# EAGLE design CBAM2.5 (EAGLE 5.07)
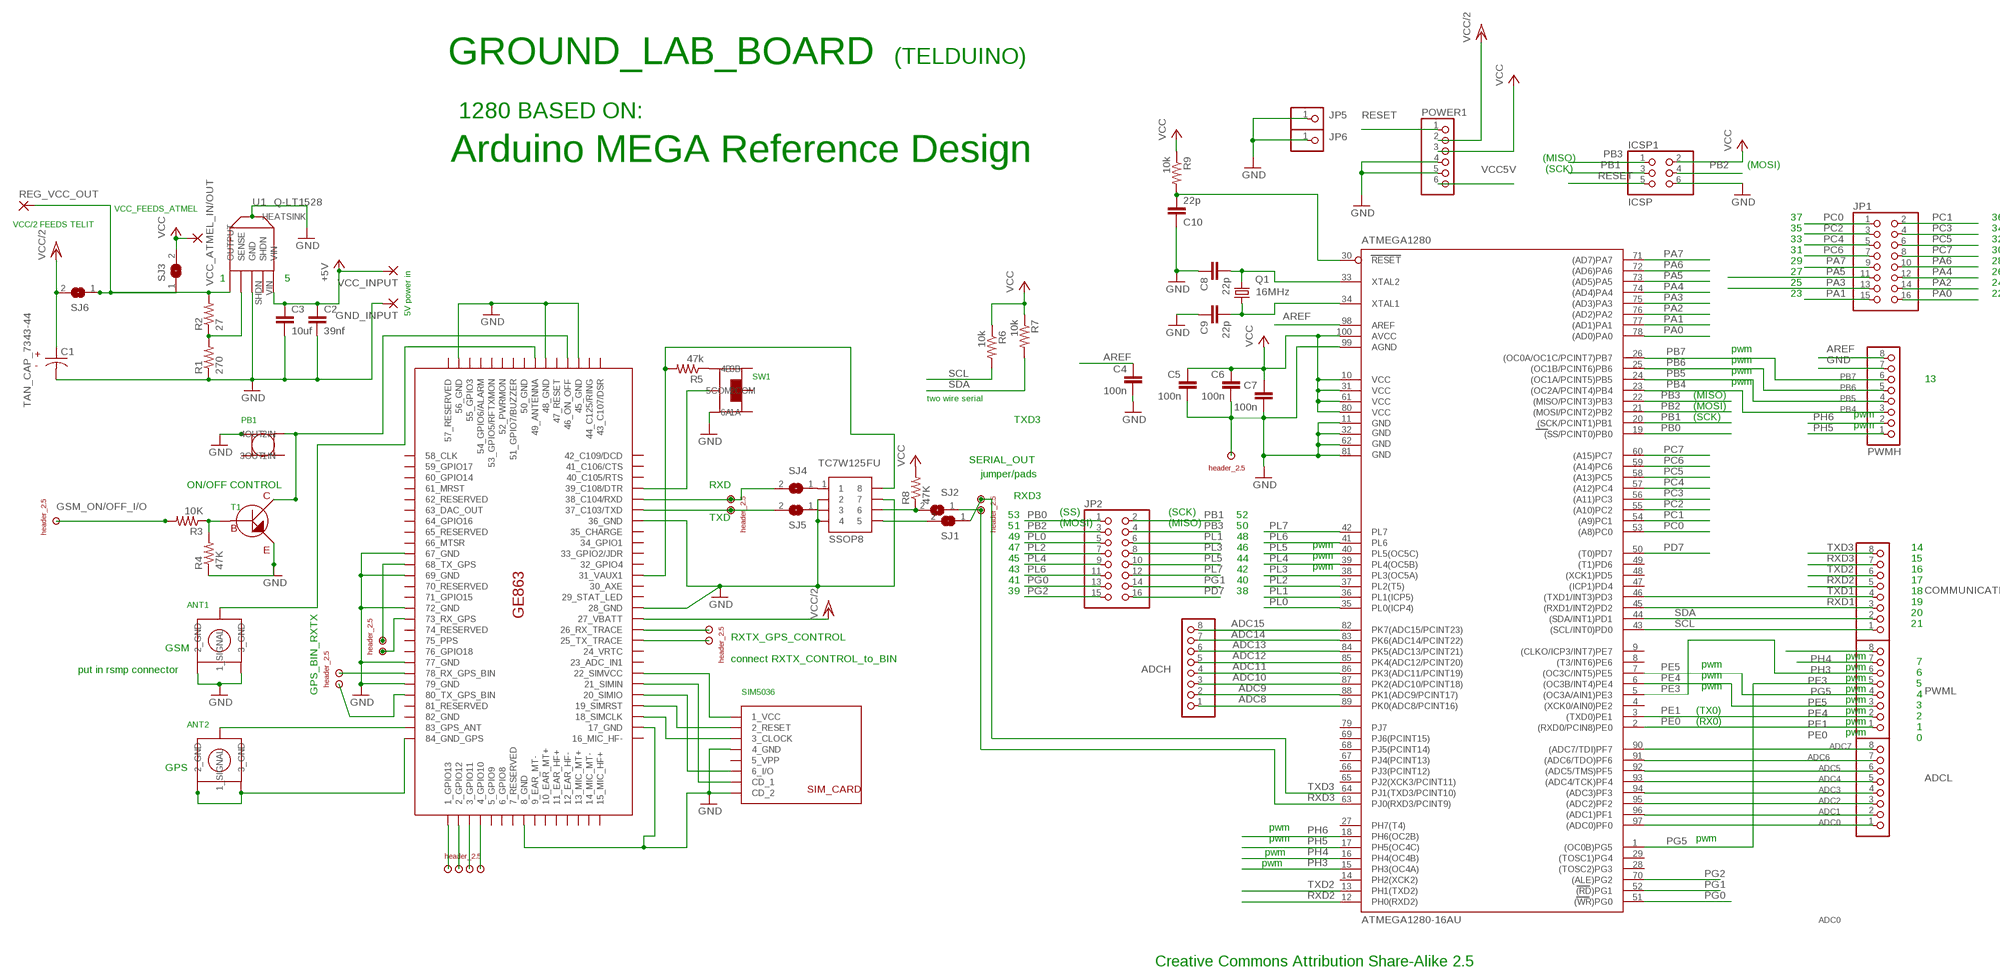
[diagram p0: schematic, sheet 1, part 1 of 2]
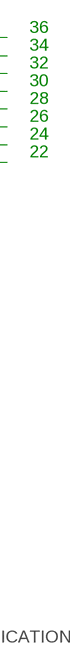
[diagram p1: schematic, sheet 1, part 2 of 2]

## Parts
ADCH  PINHD-1X8  [1X08]
ADCL  PINHD-1X8  [1X08]
AGND  2.5_1HEADER  [2.5_1HEADER]
ATMEGA1280  ATMEGA1280-16AU  [TQFP100]
C1  TAN_CAP_7343-44  [TAN_CAP_7343-44]
C2  39nf  C-EUC0805  [C0805]
C3  10uf  C-EUC1206  [C1206]
C4  100n  C-EUC0805  [C0805]
C5  100n  C-EUC0805  [C0805]
C6  100n  C-EUC0805  [C0805]
C7  100n  C-EUC0805  [C0805]
C8  22p  C-EUC0805  [C0805]
C9  22p  C-EUC0805  [C0805]
C10  22p  C-EUC0805  [C0805]
COMMUNICATION  PINHD-1X8  [1X08]
GE863  GE836  [GE836]
GND_INPUT  3,81/1,4  [3,81/1,4]
GPS_ANTENNA  U.FL_FEMALE  [U.FL_FEMALE]
GSM_ANTENNA  U.FL_FEMALE  [U.FL_FEMALE]
ICSP1  ICSP  PINHD-2X3  [2X03]
JP1  PINHD-2X8  [2X08]
JP2  PINHD-2X8  [2X08]
JP5  PINHD-1X1  [1X01]
JP6  PINHD-1X1  [1X01]
POWER  SWITCHPB_KPT-1187B  [SWITCHPB_KPT-1187B]
POWER1  PINHD-1X6  [1X06]
PWMH  PINHD-1X8  [1X08]
PWML  PINHD-1X8  [1X08]
Q1  16MHz  CRYTALHC49S  [HC49/S]
R1  270  R-US_0207/10  [0207/10]
R2  27  R-US_0207/10  [0207/10]
R3  10K  R-US_R1206  [R1206]
R4  47K  R-US_R1206  [R1206]
R5  47k  R-US_R1206  [R1206]
R6  10k  R-US_R1206  [R1206]
R7  10k  R-US_R1206  [R1206]
R8  47K  R-US_0207/10  [0207/10]
R9  10k  R-US_R1206  [R1206]
REG_VCC_OUT  3,81/1,4  [3,81/1,4]
RX/TX_ATMEL  2.5_2HEADER  [2.5_2HEADER]
RX/TX_GPS  2.5_2HEADER  [2.5_2HEADER]
RX/TX_GPS_BIN  2.5_2HEADER  [2.5_2HEADER]
RX/TX_TELIT  2.5_2HEADER  [2.5_2HEADER]
RX/TX_TRACE  2.5_2HEADER  [2.5_2HEADER]
SIM5036  SIMCARD_5036  [SIMCARD_5036]
SJ1  SJ  [SJ]
SJ2  SJ  [SJ]
SJ3  SJW  [SJW]
SJ4  SJ  [SJ]
SJ5  SJ  [SJ]
SJ6  SJW  [SJW]
SW1  SWITCHSLIDE_EG1390  [SWITCHSLIDE_EG1390]
T1  SOT-23_MMBT4403  [SOT-23_MMBT4403]
TC7W125FU  SSOP8  [SSOP8]
TELIT_I/O_PINS  2.5_4HEADER  [2.5_4HEADER]
TELIT_ON/OFF  2.5_1HEADER  [2.5_1HEADER]
U1  Q-LT1528  [Q-LT1528]
VCC_ATMEL_IN/OUT  3,81/1,4  [3,81/1,4]
VCC_INPUT  3,81/1,4  [3,81/1,4]

## Nets
1_GPIO: GE863.1_GPIO13 TELIT_I/O_PINS.P$1(H1)
2_GPIO: GE863.2_GPIO12 TELIT_I/O_PINS.P$2(H2)
3_GPIO: GE863.3_GPIO11 TELIT_I/O_PINS.P$3(H3)
4_GPIO: GE863.4_GPIO10 TELIT_I/O_PINS.P$4(H4)
25_TX_TRACE: GE863.25_TX_TRACE RX/TX_TRACE.P$2(H2)
26_RX_TRACE: GE863.26_RX_TRACE RX/TX_TRACE.P$1(H1)
31_VAUX: GE863.31_VAUX1 R5.2 TC7W125FU.8
68_TXGPS: GE863.68_TX_GPS RX/TX_GPS.P$2(H2)
73_RXGPS: GE863.73_RX_GPS RX/TX_GPS.P$1(H1)
78_RX_GPS_BIN: GE863.78_RX_GPS_BIN RX/TX_GPS_BIN.P$2(H2)
80_TX_GPS_BIN: GE863.80_TX_GPS_BIN RX/TX_GPS_BIN.P$1(H1)
ADC0: ADCL.1 ATMEGA1280.97((ADC0)PF0)
ADC1: ADCL.2 ATMEGA1280.96((ADC1)PF1)
ADC2: ADCL.3 ATMEGA1280.95((ADC2)PF2)
ADC3: ADCL.4 ATMEGA1280.94((ADC3)PF3)
ADC4: ADCL.5 ATMEGA1280.93((ADC4/TCK)PF4)
ADC5: ADCL.6 ATMEGA1280.92((ADC5/TMS)PF5)
ADC6: ADCL.7 ATMEGA1280.91((ADC6/TDO)PF6)
ADC7: ADCL.8 ATMEGA1280.90((ADC7/TDI)PF7)
ADC8: ADCH.1 ATMEGA1280.89(PK0(ADC8/PCINT16))
ADC9: ADCH.2 ATMEGA1280.88(PK1(ADC9/PCINT17))
ADC10: ADCH.3 ATMEGA1280.87(PK2(ADC10/PCINT18))
ADC11: ADCH.4 ATMEGA1280.86(PK3(ADC11/PCINT19))
ADC12: ADCH.5 ATMEGA1280.85(PK4(ADC12/PCINT20))
ADC13: ADCH.6 ATMEGA1280.84(PK5(ADC13/PCINT21))
ADC14: ADCH.7 ATMEGA1280.83(PK6(ADC14/PCINT22))
ADC15: ADCH.8 ATMEGA1280.82(PK7(ADC15/PCINT23))
AREF: ATMEGA1280.98(AREF) C4.1 PWMH.8
DTR: GE863.39_C108/DTR SW1.P$2(2COM)
GND [gnd]: AGND.P$1(H1) ATMEGA1280.11(GND) ATMEGA1280.32(GND1) ATMEGA1280.62(GND2) ATMEGA1280.81(GND3) ATMEGA1280.99(AGND) C1.NEG C2.2 C3.2 C4.2 C5.2 C6.2 C7.2 C8.1 C9.1 C10.1 GE863.8_GND GE863.17_GND GE863.28_GND GE863.36_GND GE863.45_GND GE863.48_GND GE863.56_GND GE863.67_GND GE863.69_GND GE863.72_GND GE863.77_GND GE863.79_GND GND_INPUT.1(P) GSM_ANTENNA.P$2(2_GND) GSM_ANTENNA.P$3(3_GND) ICSP1.6 JP5.1 JP6.1 POWER1.4 POWER1.5 POWER.2IN PWMH.7 R1.1 R4.1 SIM5036.4_GND SIM5036.CD_2 SW1.P$1(1A) T1.E TC7W125FU.2 TC7W125FU.4 TC7W125FU.7 U1.GND U1.HEATSINK
GSM_ON/OFF_I/O: R3.2 TELIT_ON/OFF.P$1(H1)
N$1: R8.1 SJ2.2 TC7W125FU.6
N$2: GE863.49_ANTENNA GSM_ANTENNA.P$1(1_SIGNAL)
N$3: SJ5.1 TC7W125FU.3
N$4: R5.1 SW1.P$3(3B)
N$5: SJ4.1 TC7W125FU.1
N$6: ATMEGA1280.34(XTAL1) C9.2 Q1.1
N$7: ATMEGA1280.33(XTAL2) C8.2 Q1.2
N$23: GE863.83_GPS_ANT GPS_ANTENNA.P$1(1_SIGNAL)
N$25: GE863.22_SIMVCC SIM5036.1_VCC
N$26: GE863.21_SIMIN SIM5036.CD_1
N$27: GE863.20_SIMIO SIM5036.6_I/O
N$28: GE863.19_SIMRST SIM5036.2_RESET
N$29: GE863.18_SIMCLK SIM5036.3_CLOCK
N$34: GE863.84_GND_GPS GPS_ANTENNA.P$2(2_GND) GPS_ANTENNA.P$3(3_GND)
N$53: R3.1 R4.2 T1.B
ON/OFF: GE863.46_ON_OFF POWER.4OUT T1.C
PA0: ATMEGA1280.78((AD0)PA0) JP1.16
PA1: ATMEGA1280.77((AD1)PA1) JP1.15
PA2: ATMEGA1280.76((AD2)PA2) JP1.14
PA3: ATMEGA1280.75((AD3)PA3) JP1.13
PA4: ATMEGA1280.74((AD4)PA4) JP1.12
PA5: ATMEGA1280.73((AD5)PA5) JP1.11
PA6: ATMEGA1280.72((AD6)PA6) JP1.10
PA7: ATMEGA1280.71((AD7)PA7) JP1.9
PB0: ATMEGA1280.19((SS/PCINT0)PB0) JP2.1
PB1: ATMEGA1280.20((SCK/PCINT1)PB1) ICSP1.3 JP2.2
PB2: ATMEGA1280.21((MOSI/PCINT2)PB2) ICSP1.4 JP2.3
PB3: ATMEGA1280.22((MISO/PCINT3)PB3) ICSP1.1 JP2.4
PB4: ATMEGA1280.23((OC2A/PCINT4)PB4) PWMH.3
PB5: ATMEGA1280.24((OC1A/PCINT5)PB5) PWMH.4
PB6: ATMEGA1280.25((OC1B/PCINT6)PB6) PWMH.5
PB7: ATMEGA1280.26((OC0A/OC1C/PCINT7)PB7) PWMH.6
PC0: ATMEGA1280.53((A8)PC0) JP1.1
PC1: ATMEGA1280.54((A9)PC1) JP1.2
PC2: ATMEGA1280.55((A10)PC2) JP1.3
PC3: ATMEGA1280.56((A11)PC3) JP1.4
PC4: ATMEGA1280.57((A12)PC4) JP1.5
PC5: ATMEGA1280.58((A13)PC5) JP1.6
PC6: ATMEGA1280.59((A14)PC6) JP1.7
PC7: ATMEGA1280.60((A15)PC7) JP1.8
PD7: ATMEGA1280.50((T0)PD7) JP2.16
PE0: ATMEGA1280.2((RXD0/PCIN8)PE0) PWML.1
PE1: ATMEGA1280.3((TXD0)PE1) PWML.2
PE3: ATMEGA1280.5((OC3A/AIN1)PE3) PWML.6
PE4: ATMEGA1280.6((OC3B/INT4)PE4) PWML.3
PE5: ATMEGA1280.7((OC3C/INT5)PE5) PWML.4
PG0: ATMEGA1280.51((WR)PG0) JP2.13
PG1: ATMEGA1280.52((RD)PG1) JP2.14
PG2: ATMEGA1280.70((ALE)PG2) JP2.15
PG5: ATMEGA1280.1((OC0B)PG5) PWML.5
PH3: ATMEGA1280.15(PH3(OC4A)) PWML.7
PH4: ATMEGA1280.16(PH4(OC4B)) PWML.8
PH5: ATMEGA1280.17(PH5(OC4C)) PWMH.1
PH6: ATMEGA1280.18(PH6(OC2B)) PWMH.2
PL0: ATMEGA1280.35(PL0(ICP4)) JP2.5
PL1: ATMEGA1280.36(PL1(ICP5)) JP2.6
PL2: ATMEGA1280.37(PL2(T5)) JP2.7
PL3: ATMEGA1280.38(PL3(OC5A)) JP2.8
PL4: ATMEGA1280.39(PL4(OC5B)) JP2.9
PL5: ATMEGA1280.40(PL5(OC5C)) JP2.10
PL6: ATMEGA1280.41(PL6) JP2.11
PL7: ATMEGA1280.42(PL7) JP2.12
REG_OUTPUT [power]: R2.2 REG_VCC_OUT.1(P) SJ3.1 SJ6.1 U1.OUTPUT
RESET: ATMEGA1280.30(RESET) C10.2 ICSP1.5 POWER1.1 R9.2
RXD: GE863.38_C104/RXD RX/TX_TELIT.P$1(H1) SJ4.2
RXD1: ATMEGA1280.45((RXD1/INT2)PD2) COMMUNICATION.3
RXD2: ATMEGA1280.12(PH0(RXD2)) COMMUNICATION.5
RXD3: ATMEGA1280.63(PJ0(RXD3/PCINT9)) COMMUNICATION.7 RX/TX_ATMEL.P$2(H2) SJ2.1
SCL: ATMEGA1280.43((SCL/INT0)PD0) COMMUNICATION.1 R6.2
SDA: ATMEGA1280.44((SDA/INT1)PD1) COMMUNICATION.2 R7.2
SENCE: R1.2 R2.1 U1.SENCE(SENSE)
TXD: GE863.37_C103/TXD RX/TX_TELIT.P$2(H2) SJ5.2
TXD1: ATMEGA1280.46((TXD1/INT3)PD3) COMMUNICATION.4
TXD2: ATMEGA1280.13(PH1(TXD2)) COMMUNICATION.6
TXD3: ATMEGA1280.64(PJ1(TXD3/PCINT10)) COMMUNICATION.8 RX/TX_ATMEL.P$1(H1) SJ1.1
TXD_IN: SJ1.2 TC7W125FU.5
VCC [VCC]: ATMEGA1280.10(VCC) ATMEGA1280.31(VCC1) ATMEGA1280.61(VCC2) ATMEGA1280.80(VCC3) ATMEGA1280.100(AVCC) C5.1 C6.1 C7.1 ICSP1.2 POWER1.3 R6.1 R7.1 R8.2 R9.1 SJ3.2 VCC_ATMEL_IN/OUT.1(P)
VCC5V [power]: C2.1 C3.1 POWER1.6 U1.VIN VCC_INPUT.1(P) ; supply symbol labelled +5V
VCC/2 [power]: C1.POS GE863.27_VBATT POWER1.2 SJ6.2
Unconnected: ATMEGA1280.4((XCK0/AIN0)PE2) ATMEGA1280.8((T3/INT6)PE6) ATMEGA1280.9((CLKO/ICP3/INT7)PE7) ATMEGA1280.14(PH2(XCK2)) ATMEGA1280.27(PH7(T4)) ATMEGA1280.28((TOSC2)PG3) ATMEGA1280.29((TOSC1)PG4) ATMEGA1280.47((ICP1)PD4) ATMEGA1280.48((XCK1)PD5) ATMEGA1280.49((T1)PD6) ATMEGA1280.65(PJ2(XCK3/PCINT11)) ATMEGA1280.66(PJ3(PCINT12)) ATMEGA1280.67(PJ4(PCINT13)) ATMEGA1280.68(PJ5(PCINT14)) ATMEGA1280.69(PJ6(PCINT15)) ATMEGA1280.79(PJ7) GE863.5_GPIO9 GE863.6_GPIO8 GE863.7_RESERVED GE863.9_EAR_MT- GE863.10_EAR_MT+ GE863.11_EAR_HF+ GE863.12_EAR_HF- GE863.13_MIC_MT+ GE863.14_MIC_MT- GE863.15_MIC_HF+ GE863.16_MIC_HF- GE863.23_ADC_IN1 GE863.24_VRTC GE863.29_STAT_LED GE863.30_AXE GE863.32_GPIO4 GE863.33_GPIO2/JDR GE863.34_GPIO1 GE863.35_CHARGE GE863.40_C105/RTS GE863.41_C106/CTS GE863.42_C109/DCD GE863.43_C107/DSR GE863.44_C125/RING GE863.47_RESET GE863.50_GND GE863.51_GPIO7/BUZZER GE863.52_PWRMON GE863.53_GPIO5/RFTXMON GE863.54_GPIO6/ALARM GE863.55_GPIO3 GE863.57_RESERVED GE863.58_CLK GE863.59_GPIO17 GE863.60_GPIO14 GE863.61_MRST GE863.62_RESERVED GE863.63_DAC_OUT GE863.64_GPIO16 GE863.65_RESERVED GE863.66_MTSR GE863.70_RESERVED GE863.71_GPIO15 GE863.74_RESERVED GE863.75_PPS GE863.76_GPIO18 GE863.81_RESERVED GE863.82_GND POWER.1IN POWER.3OUT SIM5036.5_VPP SW1.P$4(4B) SW1.P$5(5COM) SW1.P$6(6A) U1.SHDN

## Notes on the sheet
- GROUND_LAB_BOARD | (TELDUINO)
- 1280 BASED ON:
- Arduino MEGA Reference Design | (MISO)
- (MOSI)
- (SCK)
- VCC_FEEDS_ATMEL
- 37 | 36
- VCC/2 FEEDS TELIT
- 35 | 34
- 33 | 32
- 31 | 30
- 29 | 28
- 5V power in
- 27 | 26
- 1 | 5
- 25 | 24
- 23 | 22
- pwm
- pwm
- pwm
- SW1
- pwm | 13
- (MISO)
- two wire serial
- (MOSI)
- (SCK) | pwm
- PB1 | TXD3
- pwm
- SERIAL_OUT
- jumper/pads
- ON/OFF CONTROL | RXD
- RXD3
- T1
- 53 | (SS) | (SCK) | 52
- TXD
- 51 | (MOSI) | (MISO) | 50
- 49 | 48
- 47 | 46 | pwm | 14
- 45 | 44 | pwm | 15
- 43 | 42 | pwm | 16
- 41 | 40 | 17
- 39 | 38 | 18
- 19
- ANT1
- 20
- 21
- RXTX_GPS_CONTROL
- GSM
- connect RXTX_CONTROL_to_BIN | pwm
- pwm | 7
- put in rsmp connector | pwm
- pwm | 6
- pwm
- pwm | 5
- GPS_BIN_RXTX | pwm
- SIM5036
- 4
- pwm
- 3
- (TX0) | pwm
- 2
- (RX0) | pwm
- ANT2
- 1
- pwm
- 0
- GPS
- pwm
- pwm | pwm
- pwm
- pwm
- Creative Commons Attribution Share-Alike 2.5

## Library data of the parts
ADCH ADCL COMMUNICATION PWMH PWML = pinhead:PINHD-1X8: PIN HEADER
AGND TELIT_ON/OFF = myHeaders:2.5_1HEADER
ATMEGA1280 = atmel-2005:ATMEGA*: MICROCONTROLLER 64/128/256 Kbytes FLASH 4 Kbytes EEPROM 8 Kbytes SRAM 86 General Purpose I/O pins 12-channels16-bit PWM 4 x Serial USARTs 16-channels 10-bit A/D
C1 = myLib:TAN_CAP_7343-44
C2-C10 = rcl:C-EU: CAPACITOR, European symbol
GE863 = myLib:GE836
GND_INPUT REG_VCC_OUT VCC_ATMEL_IN/OUT VCC_INPUT = wirepad:3,81/1,4: THROUGH-HOLE PAD
GPS_ANTENNA GSM_ANTENNA = myLib:U.FL_FEMALE
ICSP1 = pinhead:PINHD-2X3: PIN HEADER
JP1 JP2 = pinhead:PINHD-2X8: PIN HEADER
JP5 JP6 = pinhead:PINHD-1X1: PIN HEADER
POWER = myLib:SWITCHPB_KPT-1187B
POWER1 = pinhead:PINHD-1X6: PIN HEADER
Q1 = crystal:CRYTAL: CRYSTAL
R1-R9 = rcl:R-US_: RESISTOR, American symbol
RX/TX_ATMEL RX/TX_GPS RX/TX_GPS_BIN RX/TX_TELIT RX/TX_TRACE = myHeaders:2.5_2HEADER
SIM5036 = myLib:SIMCARD_5036
SJ1-SJ6 = jumper:SJ: SMD solder JUMPER
SW1 = myLib:SWITCHSLIDE_EG1390
T1 = mytransistors:SOT-23_MMBT4403
TC7W125FU = myIC:SSOP8: ssop8 package
TELIT_I/O_PINS = myHeaders:2.5_4HEADER: 2.5mm header spacing 1mm holes
U1 = myPowerRegulators:Q-LT1528: Q package for the LT1528 power Regulator, the heatsink connects to GND

## Net classes
0 default: width 0.203 mm, drill 0.406 mm, clearance 0.203 mm
1 power: width 0.61 mm, drill 0.711 mm, clearance 0.203 mm
2 gnd: width 0.305 mm, drill 0.711 mm, clearance 0.203 mm
3 VCC: width 0.508 mm, drill 0.711 mm, clearance 0.203 mm

## Board
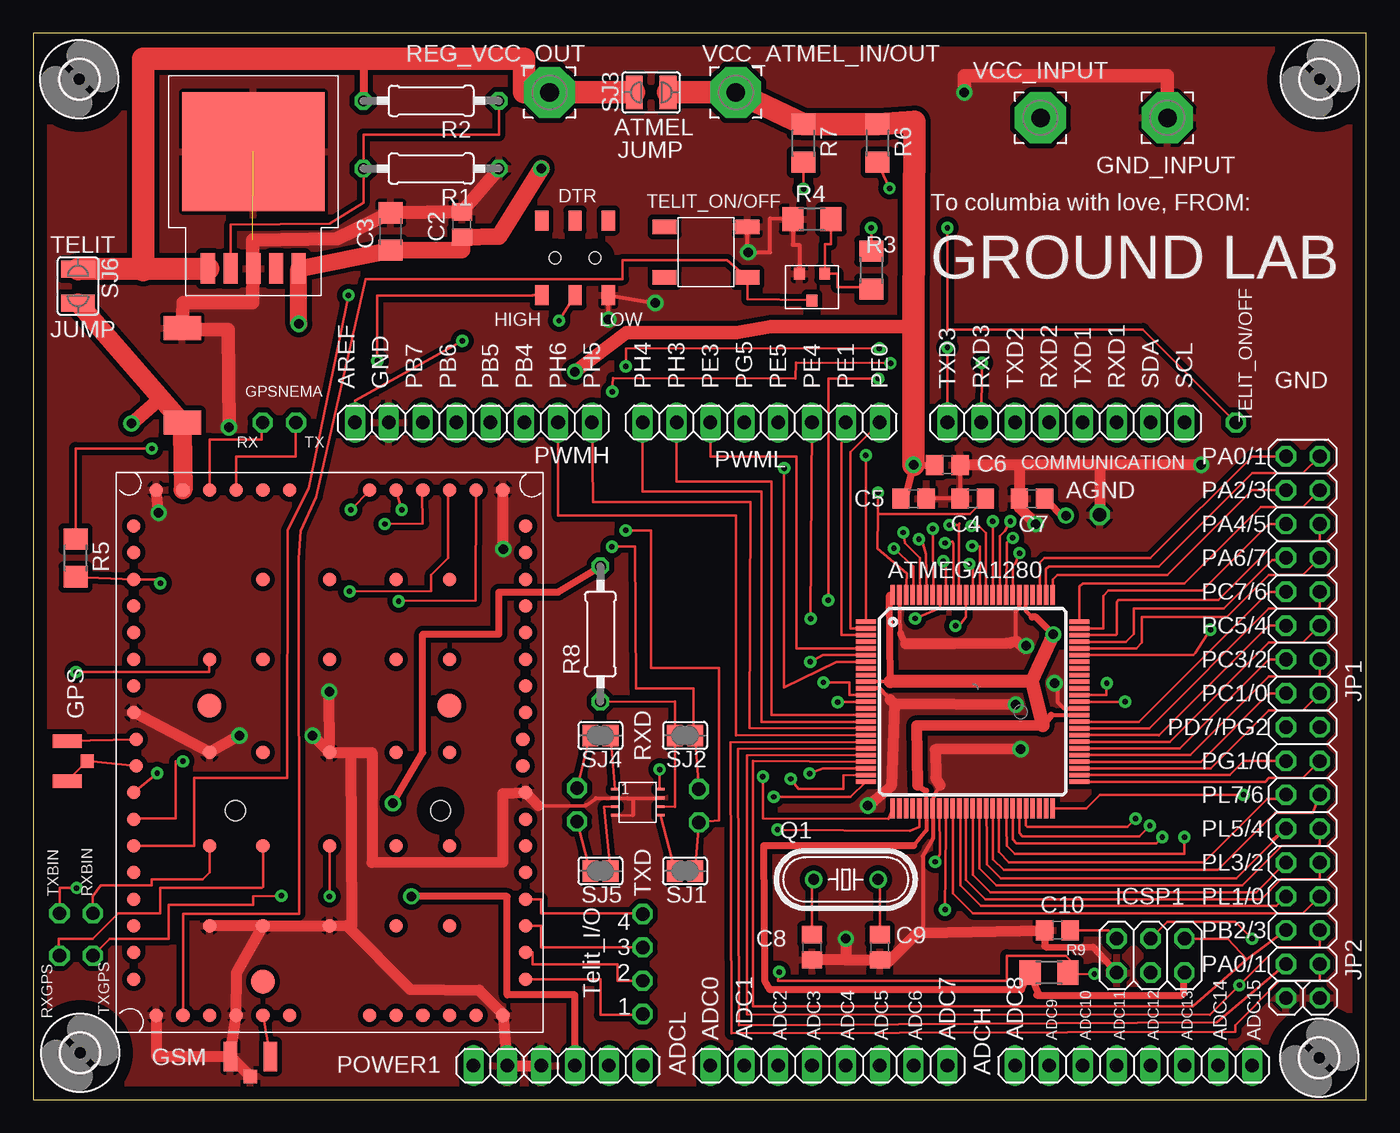
[diagram p2: board, top side]
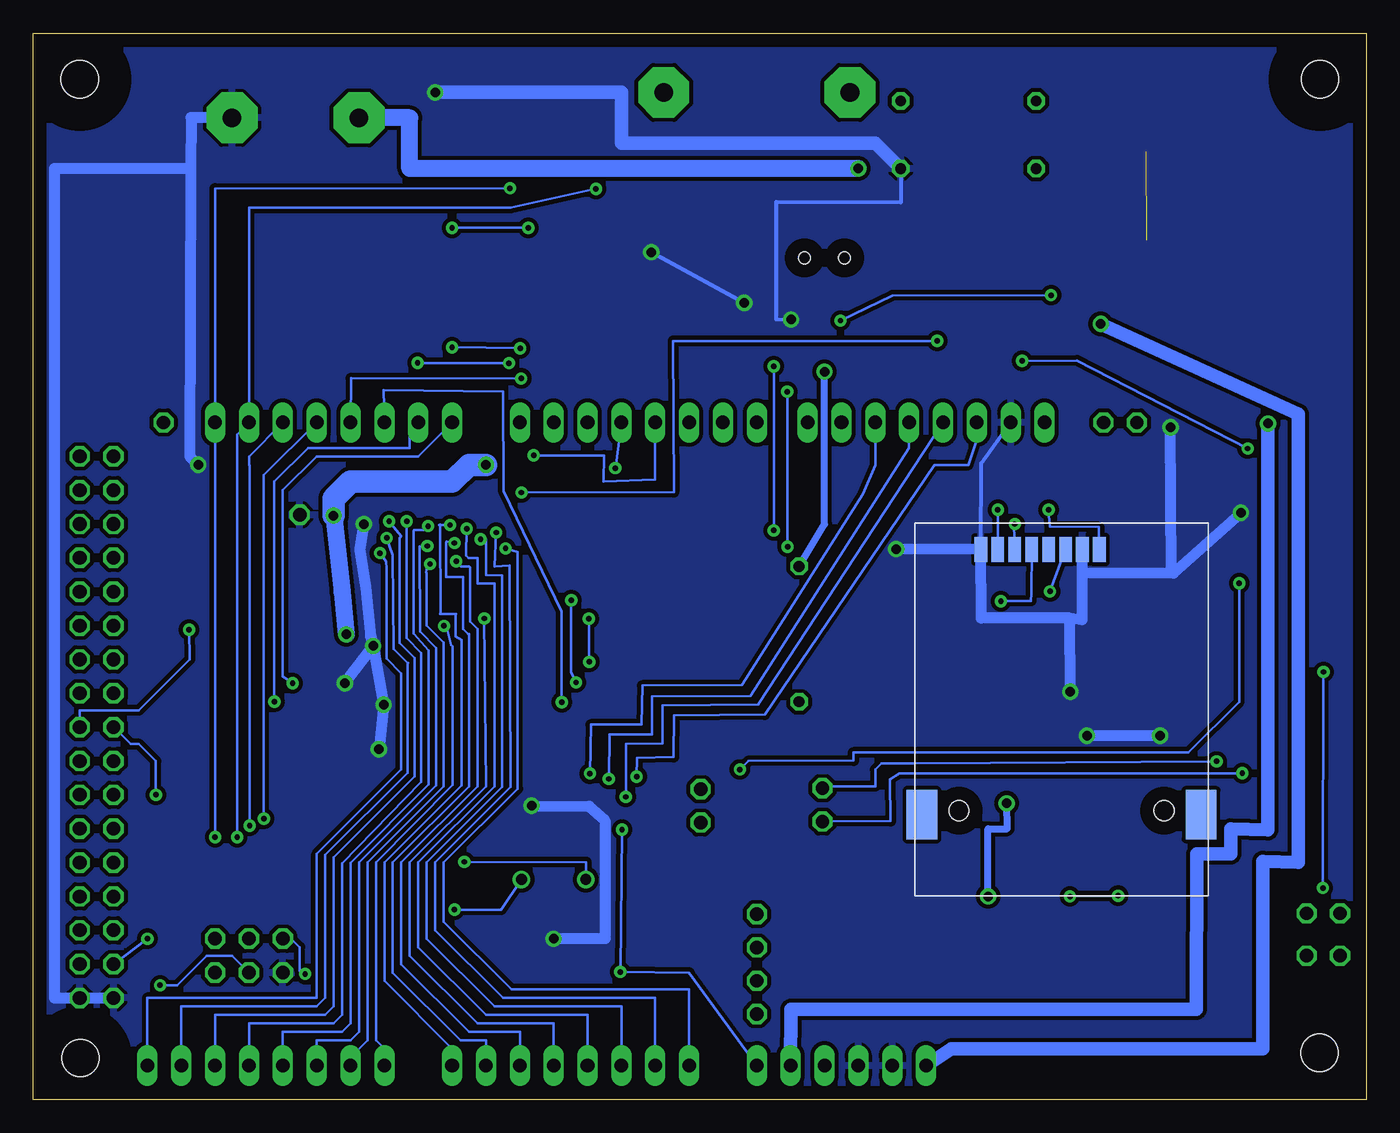
[diagram p3: board, bottom side, seen from below]

Size 100 x 80 mm. Coordinates in mm from the lower left corner, seen from the top.
Outline: 0,0 100,0 100,80 0,80 0,0
Copper layers (1*16): Top 0.035mm / dielectric 1.5mm / Bottom 0.035mm
Design rules "default *": minimum track width 8mil, minimum drill 16mil, track to track 8mil, track to pad 8mil, pad to pad 8mil, via to via 10mil, smd to smd 8mil, copper to edge 40mil, drill to drill 12mil, minimum pad ring 10mil, minimum via ring 10mil, stop-mask expansion 4mil, vias tented up to drill 0mil, thermal gap 10mil

### Footprints (pad centres in the part's own frame; a part is rotated, then mirrored left to right if it is on the bottom)
1X08 = drill 1.016 long: 1 -8.89,0; 2 -6.35,0; 3 -3.81,0; 4 -1.27,0; 5 1.27,0; 6 3.81,0; 7 6.35,0; 8 8.89,0
2.5_1HEADER = drill 1 octagon: P$1 0.06,0
TQFP100 = smd 1.5 x 0.35: 1 -8,6; 2 -8,5.5; 3 -8,5; 4 -8,4.5; 5 -8,4; 6 -8,3.5; 7 -8,3; 8 -8,2.5; 9 -8,2; 10 -8,1.5; 11 -8,1; 12 -8,0.5; 13 -8,0; 14 -8,-0.5; 15 -8,-1; 16 -8,-1.5; 17 -8,-2; 18 -8,-2.5; 19 -8,-3; 20 -8,-3.5; 21 -8,-4; 22 -8,-4.5; 23 -8,-5; 24 -8,-5.5; 25 -8,-6; 51 8,-6; 52 8,-5.5; 53 8,-5; 54 8,-4.5; 55 8,-4; 56 8,-3.5; 57 8,-3; 58 8,-2.5; 59 8,-2; 60 8,-1.5; 61 8,-1; 62 8,-0.5; 63 8,0; 64 8,0.5; 65 8,1; 66 8,1.5; 67 8,2; 68 8,2.5; 69 8,3; 70 8,3.5; 71 8,4; 72 8,4.5; 73 8,5; 74 8,5.5; 75 8,6 | smd 0.35 x 1.5: 26 -6,-8; 27 -5.5,-8; 28 -5,-8; 29 -4.5,-8; 30 -4,-8; 31 -3.5,-8; 32 -3,-8; 33 -2.5,-8; 34 -2,-8; 35 -1.5,-8; 36 -1,-8; 37 -0.5,-8; 38 0,-8; 39 0.5,-8; 40 1,-8; 41 1.5,-8; 42 2,-8; 43 2.5,-8; 44 3,-8; 45 3.5,-8; 46 4,-8; 47 4.5,-8; 48 5,-8; 49 5.5,-8; 50 6,-8; 76 6,8; 77 5.5,8; 78 5,8; 79 4.5,8; 80 4,8; 81 3.5,8; 82 3,8; 83 2.5,8; 84 2,8; 85 1.5,8; 86 1,8; 87 0.5,8; 88 0,8; 89 -0.5,8; 90 -1,8; 91 -1.5,8; 92 -2,8; 93 -2.5,8; 94 -3,8; 95 -3.5,8; 96 -4,8; 97 -4.5,8; 98 -5,8; 99 -5.5,8; 100 -6,8
TAN_CAP_7343-44 = smd 2.8 x 1.8: NEG 0,-3.5; POS 0,3.6
C0805 = smd 1.3 x 1.5: 1 -0.95,0; 2 0.95,0
C1206 = smd 1.6 x 1.8: 1 -1.4,0; 2 1.4,0
GE836 = smd 1 x 1: 1_GPIO13 -14.7,17; 2_GPIO12 -14.7,15; 3_GPIO11 -14.7,13; 4_GPIO10 -14.7,11; 5_GPIO9 -14.7,9; 6_GPIO8 -14.7,7; 7_RESERVED -14.7,5; 8_GND -14.7,3; 9_EAR_MT- -14.7,-3; 10_EAR_MT+ -14.7,-5; 11_EAR_HF+ -14.7,-7; 12_EAR_HF- -14.7,-9; 13_MIC_MT+ -14.7,-11; 14_MIC_MT- -14.7,-13; 15_MIC_HF+ -14.7,-15; 16_MIC_HF- -14.7,-17; 17_GND -13,-19.7; 18_SIMCLK -11,-19.7; 19_SIMRST -9,-19.7; 20_SIMIO -7,-19.7; 21_SIMIN -5,-19.7; 22_SIMVCC -3,-19.7; 23_ADC_IN1 3,-19.7; 24_VRTC 5,-19.7; 25_TX_TRACE 7,-19.7; 26_RX_TRACE 9,-19.7; 27_VBATT 11,-19.7; 28_GND 13,-19.7; 29_STAT_LED 14.7,-17; 30_AXE 14.7,-15; 31_VAUX1 14.7,-13; 32_GPIO4 14.7,-11; 33_GPIO2/JDR 14.7,-9; 34_GPIO1 14.7,-7; 35_CHARGE 14.7,-5; 36_GND 14.7,-3; 37_C103/TXD 14.7,3; 38_C104/RXD 14.7,5; 39_C108/DTR 14.7,7; 40_C105/RTS 14.7,9; 41_C106/CTS 14.7,11; 42_C109/DCD 14.7,13; 43_C107/DSR 14.7,15; 44_C125/RING 14.7,17; 45_GND 13,19.7; 46_ON_OFF 11,19.7; 47_RESET 9,19.7; 48_GND 7,19.7; 49_ANTENNA 5,19.7; 50_GND 3,19.7; 51_GPIO7/BUZZER -3,19.7; 52_PWRMON -5,19.7; 53_GPIO5/RFTXMON -7,19.7; 54_GPIO6/ALARM -9,19.7; 55_GPIO3 -11,19.7; 56_GND -13,19.7; 57_RESERVED -9,13; 58_CLK -9,7; 59_GPIO17 -9,0; 60_GPIO14 -9,-7; 61_MRST -9,-13; 62_RESERVED -5,13; 63_DAC_OUT -5,7; 64_GPIO16 -5,0; 65_RESERVED -5,-7; 66_MTSR -5,-13; 67_GND 0,13; 68_TX_GPS 0,7; 69_GND 0,0; 70_RESERVED 0,-7; 71_GPIO15 0,-13; 72_GND 5,13; 73_RX_GPS 5,7; 74_RESERVED 5,0; 75_PPS 5,-7; 76_GPIO18 5,-13; 77_GND 9,13; 78_RX_GPS_BIN 9,7; 79_GND 9,0; 80_TX_GPS_BIN 9,-7; 81_RESERVED -14.5,1; 82_GND -14.5,-1; 83_GPS_ANT 14.5,-1; 84_GND_GPS 14.5,1 | smd 1.8 x 1.8: P$85 5,17.2; P$86 9,-3.5; P$87 -9,-3.5
3,81/1,4 = drill 1.397 pad 3.81 octagon: 1 0,0
U.FL_FEMALE = smd 1 x 2.2: P$1 -1.5,0; P$2 1.5,0 | smd 1 x 1: P$3 0,1.5
2X03 = drill 1.016 octagon: 1 -2.54,-1.27; 2 -2.54,1.27; 3 0,-1.27; 4 0,1.27; 5 2.54,-1.27; 6 2.54,1.27
2X08 = drill 1.016 octagon: 1 -8.89,-1.27; 2 -8.89,1.27; 3 -6.35,-1.27; 4 -6.35,1.27; 5 -3.81,-1.27; 6 -3.81,1.27; 7 -1.27,-1.27; 8 -1.27,1.27; 9 1.27,-1.27; 10 1.27,1.27; 11 3.81,-1.27; 12 3.81,1.27; 13 6.35,-1.27; 14 6.35,1.27; 15 8.89,-1.27; 16 8.89,1.27
1X01 = drill 1.016 octagon: 1 0,0
SWITCHPB_KPT-1187B = smd 1.8 x 1.1: 1IN -3.1,1.9; 2IN 3.1,1.9; 3OUT -3.1,-1.9; 4OUT 3.1,-1.9
1X06 = drill 1.016 long: 1 -6.35,0; 2 -3.81,0; 3 -1.27,0; 4 1.27,0; 5 3.81,0; 6 6.35,0
HC49/S = drill 0.813 round: 1 -2.413,0; 2 2.413,0
0207/10@1 = drill 0.813 octagon: 1 -5.08,0; 2 5.08,0
R1206@1 = smd 1.6 x 1.803: 1 -1.422,0; 2 1.422,0
R1206 = smd 1.6 x 1.803: 1 -1.422,0; 2 1.422,0
2.5_2HEADER = drill 1 octagon: P$1 -2.48,0; P$2 0.02,0
SIMCARD_5036 = smd 1.9 x 0.95: 1_VCC 0,2.84; 2_RESET 0,0.3; 3_CLOCK 0,-2.24; 4_GND 0,1.57; 5_VPP 0,-0.97; 6_I/O 0,-3.51; CD_1 0,-4.78; CD_2 0,-6.05 | smd 3.7 x 2.3: P$9 19.9,-10.47; P$10 19.9,10.47 | hole 1.5: 19.6,-7.7; 19.6,7.7
SJ = smd 1.168 x 1.6: 1 -0.762,0; 2 0.762,0
SJW = smd 1.27 x 2.54: 1 -1.27,0; 2 1.27,0
SWITCHSLIDE_EG1390 = smd 1 x 1.5: P$1 -2.5,0; P$2 0,0; P$3 2.5,0; P$4 0,-5.6; P$5 2.5,-5.6; P$6 -2.5,-5.6 | hole 0.889: -1.5,-2.8; 1.5,-2.8
SOT-23_MMBT4403 = smd 0.8 x 0.9: B -0.95,-1; C 0,1; E 0.94,-1
SSOP8 = smd 0.6 x 0.2: 1 -1.7,0.975; 2 -1.7,0.325; 3 -1.7,-0.325; 4 -1.7,-0.975; 5 1.7,-0.975; 6 1.7,-0.325; 7 1.71,0.325; 8 1.7,0.975
2.5_4HEADER = drill 1 octagon: P$1 -3.75,0; P$2 -1.25,0; P$3 1.25,0; P$4 3.75,0
Q-LT1528 = smd 1.067 x 2.286: GND 0,-4.318; OUTPUT -3.404,-4.318; SENCE -1.702,-4.318; SHDN 1.702,-4.318; VIN 3.404,-4.318 | smd 10.668 x 8.89: HEATSINK 0,4.445
2,8 = hole 2.8: 0,0

### Placement (x,y rotation side)
ADCH  82.55,2.54 0 top
ADCL  59.69,2.54 0 top
AGND  80.01,43.81 90 top
ATMEGA1280  70.48,29.84 0 top
C1  11.18,54.38 180 top
C2  32.16,65.66 90 top
C3  26.82,65.13 90 top
C4  70.48,45.09 180 top
C5  66.04,45.09 0 top
C6  68.58,47.62 0 top
C7  74.93,45.09 180 top
C8  58.42,11.43 90 top
C9  63.5,11.43 90 top
C10  76.83,12.7 0 top
COMMUNICATION  77.47,50.8 180 top
GE863  22.23,26.04 180 top
GND_INPUT  85.09,73.66 270 top
GPS_ANTENNA  2.54,25.4 270 top
GSM_ANTENNA  16.28,3.23 180 top
ICSP1  83.82,10.79 180 top
JP1  95.25,39.37 90 top
JP2  95.25,19.05 90 top
JP5  96.52,7.62 0 top
JP6  93.98,7.62 0 top
POWER  50.47,63.58 0 top
POWER1  39.37,2.54 180 top
PWMH  33.02,50.8 180 top
PWML  54.61,50.8 180 top
Q1  60.96,16.51 180 top
R1  270  [0207/10@1]  29.84,69.85 180 top
R2  27  [0207/10@1]  29.84,74.93 180 top
R3  10K  [R1206@1]  62.87,62.23 90 top
R4  47K  [R1206@1]  58.42,66.04 0 top
R5  47k  [R1206@1]  3.17,40.64 270 top
R6  10k  [R1206@1]  63.35,71.75 270 top
R7  10k  [R1206@1]  57.78,71.75 270 top
R8  47K  [0207/10@1]  42.55,34.92 90 top
R9  76.2,9.53 0 top
REG_VCC_OUT  38.73,75.56 0 top
RX/TX_ATMEL  49.94,23.27 90 top
RX/TX_GPS  4.45,10.79 0 top
RX/TX_GPS_BIN  4.45,13.97 0 top
RX/TX_TELIT  40.79,20.88 270 top
RX/TX_TRACE  19.68,50.8 0 top
SIM5036  22.86,41.27 270 bottom
SJ1  48.9,17.14 180 top
SJ2  48.9,27.3 180 top
SJ3  46.35,75.56 0 top
SJ4  42.55,27.3 180 top
SJ5  42.55,17.14 180 top
SJ6  3.35,61.04 270 top
SW1  40.64,60.35 180 top
T1  58.42,60.96 180 top
TC7W125FU  45.34,22.3 0 top
TELIT_I/O_PINS  45.72,10.16 90 top
TELIT_ON/OFF  90.17,50.8 0 top
U1  16.51,66.67 0 top
U$1  [2,8]  96.47,3.12 0 top
U$2  [2,8]  3.51,3.51 0 top
U$3  [2,8]  3.45,76.56 0 top
U$4  [2,8]  96.52,76.56 0 top
VCC_ATMEL_IN/OUT  52.7,75.56 0 top
VCC_INPUT  75.56,73.66 270 top

### Tracks (layer width: path | path; a pad name or v marks a point on that pad's centre or on a via)
1_GPIO
  Top 0.203: GE863.1_GPIO13 42.55,9.04 42.55,6.35 45.72,6.35 TELIT_I/O_PINS.P$1
2_GPIO
  Top 0.203: GE863.2_GPIO12 37.47,11.04 37.47,10.16 43.81,10.16 43.81,8.89 45.72,8.89 TELIT_I/O_PINS.P$2
3_GPIO
  Top 0.203: GE863.3_GPIO11 38.1,13.04 38.1,11.43 45.72,11.43 TELIT_I/O_PINS.P$3
4_GPIO
  Top 0.203: GE863.4_GPIO10 38.1,15.04 38.1,13.97 45.72,13.97 TELIT_I/O_PINS.P$4
25_TX_TRACE
  Top 0.203: RX/TX_TRACE.P$2 19.68,50.8 19.68,48.26 15.22,48.26 GE863.25_TX_TRACE
26_RX_TRACE
  Top 0.203: RX/TX_TRACE.P$1 17.14,50.8 17.14,49.53 13.23,49.53 13.23,49.12 13.22,49.12 GE863.26_RX_TRACE
31_VAUX  (via drill 0.41)
  Top 0.203: R5.2 GE863.31_VAUX1 9.22,39.03 v9.53,38.73 | TC7W125FU.8 46.99,23.32 v46.99,24.77
  Bottom 0.203: v46.99,24.77 46.35,25.4 38.46,25.43 38.48,26.04 13.34,26.04 9.53,29.84 v9.53,38.73
68_TXGPS  (via drill 0.41)
  Top 0.203: v22.23,15.24 GE863.68_TX_GPS | v18.62,15.29 16.51,15.24 16.51,14.61 10.16,14.61 10.16,12.06 5.74,12.06 RX/TX_GPS.P$2
  Bottom 0.203: v18.62,15.29 v22.23,15.24
73_RXGPS
  Top 0.203: GE863.73_RX_GPS 17.23,15.96 17.14,15.88 9.53,15.88 9.53,13.97 6.35,13.97 4.45,12.06 1.91,12.06 1.91,10.86 RX/TX_GPS.P$1
78_RX_GPS_BIN
  Top 0.203: GE863.78_RX_GPS_BIN 13.22,17.04 12.7,16.51 8.89,16.51 8.87,16.08 5.05,16.08 4.45,15.24 4.45,13.99 RX/TX_GPS_BIN.P$2
80_TX_GPS_BIN  (via drill 0.41)
  Top 0.203: GE863.80_TX_GPS_BIN 13.18,32.08 v3.2,32.08 | RX/TX_GPS_BIN.P$1 1.98,15.88 v3.25,15.88
  Bottom 0.203: v3.25,15.88 v3.2,32.08
ADC0  (via drill 0.41)
  Top 0.203: ATMEGA1280.97 66.04,37.9 66.04,40.01 v64.57,41.35
  Bottom 0.203: ADCL.1 50.8,8.26 64.14,8.26 69.22,13.34 69.22,17.78 63.65,23.32 63.65,41.1 v64.57,41.35
ADC1  (via drill 0.41)
  Top 0.203: ATMEGA1280.96 66.52,37.88 66.52,40.64 65.41,41.76 v65.28,42.55
  Bottom 0.203: ADCL.2 53.34,7.62 64.77,7.62 69.85,12.7 69.85,17.78 64.21,23.47 64.26,40.08 65.41,40.01 v65.28,42.55
ADC2  (via drill 0.41)
  Top 0.203: ATMEGA1280.95 67.03,37.89 66.98,40.95 66.73,41.73 v66.45,42.04
  Bottom 0.203: ADCL.3 55.88,6.99 65.41,6.99 70.48,12.06 70.48,17.78 64.85,23.44 64.85,39.32 66.04,39.37 66.04,42.04 v66.45,42.04
ADC3  (via drill 0.41)
  Top 0.203: ATMEGA1280.94 67.54,37.9 v67.49,42.82
  Bottom 0.203: v67.49,42.82 67.54,40.82 67.36,40.64 66.67,40.64 66.67,38.73 65.41,38.73 65.41,23.5 71.12,17.78 71.12,11.43 66.04,6.35 58.42,6.35 ADCL.4
ADC4  (via drill 0.41)
  Top 0.203: ATMEGA1280.93 68.02,37.86 68.02,36.88 v66.17,36.09
  Bottom 0.203: v66.17,36.09 66.04,23.5 71.75,17.78 71.75,10.79 66.67,5.71 60.96,5.71 ADCL.5
ADC5  (via drill 0.41)
  Top 0.203: ATMEGA1280.92 68.48,37.91 68.48,39.98 68.28,40.31 v68.28,40.39
  Bottom 0.203: v68.28,40.39 67.92,40.01 67.31,40.01 67.23,39.93 67.23,35.87 66.67,35.31 66.67,23.5 72.39,17.78 72.39,10.16 67.31,5.08 63.5,5.08 ADCL.6
ADC6  (via drill 0.41)
  Top 0.203: ATMEGA1280.91 69.04,37.85 69.04,41.73 68.96,41.86 v68.4,41.76
  Bottom 0.203: ADCL.7 66.04,4.45 67.94,4.45 73.03,9.53 73.03,17.78 67.31,23.5 67.31,34.92 67.39,34.92 67.77,35.31 67.77,39.22 69.04,39.19 69.04,41.81 69.01,41.86 v68.4,41.76
ADC7  (via drill 0.41)
  Top 0.203: ATMEGA1280.90 69.44,37.98 69.44,43.1 | 69.44,43.1 69.49,43.23 | v68.73,43.1 69.44,43.1
  Bottom 0.203: v68.73,43.1 69.57,43.1 69.47,43.16 69.44,36.52 69.49,36.42 68.28,36.42 68.3,36.4 68.3,34.75 67.87,34.47 67.87,23.57 73.66,17.78 73.66,8.89 68.58,3.81 ADCL.8
ADC8  (via drill 0.41)
  Top 0.203: ATMEGA1280.89 69.98,37.83 69.98,36.22 69.47,35.59 v69.19,35.53
  Bottom 0.203: ADCH.1 73.66,3.81 74.3,4.45 74.3,17.78 68.53,23.6 68.53,34.01 68.66,34.11 68.96,35.31 v69.19,35.53
ADC9  (via drill 0.41)
  Top 0.203: ATMEGA1280.88 70.51,37.87 70.51,39.62 70.46,40.13 v70.23,40.18
  Bottom 0.203: v70.23,40.18 70.51,39.75 70.54,39.55 70.48,39.5 70.48,35.56 69.22,34.29 69.22,23.5 74.93,17.78 74.93,4.45 76.2,3.17 ADCH.2
ADC10  (via drill 0.41)
  Top 0.203: ATMEGA1280.87 71.02,37.89 71.02,41.5 70.87,41.48 v70.43,41.53
  Bottom 0.203: v70.43,41.53 71.02,41.5 70.97,35.13 69.77,33.88 69.77,23.57 75.56,17.78 75.56,5.08 76.2,4.45 78.74,4.45 ADCH.3
ADC11  (via drill 0.41)
  Top 0.203: ATMEGA1280.86 71.48,37.85 71.48,42.49 70.94,43.03 v70.38,43.03
  Bottom 0.203: v70.38,43.03 70.69,42.72 71.42,42.72 71.48,42.67 71.48,34.98 70.36,33.68 70.36,23.65 76.2,17.75 76.2,5.71 76.83,5.08 81.28,5.08 ADCH.4
ADC12  (via drill 0.41)
  Top 0.203: ATMEGA1280.85 v71.98,43.38
  Bottom 0.203: v71.98,43.38 71.98,34.62 70.89,33.5 70.89,23.82 76.83,17.7 76.83,6.35 77.47,5.71 83.82,5.71 ADCH.5
ADC13  (via drill 0.41)
  Top 0.203: ATMEGA1280.84 72.52,37.88 72.52,42.29 72.9,42.67 v73.3,43.38
  Bottom 0.203: v73.3,43.38 72.42,42.27 72.44,42.19 72.52,42.11 72.52,34.27 71.4,33.15 71.4,24.26 77.47,18.19 77.47,6.99 78.11,6.35 86.36,6.35 ADCH.6
ADC14  (via drill 0.41)
  Top 0.203: ATMEGA1280.83 73,37.86 73.05,41.78 73.48,42.22 v73.48,42.14
  Bottom 0.203: v73.48,42.14 73.03,40.87 72.97,33.81 71.91,32.74 71.88,32.74 71.93,32.69 71.93,24.51 78.11,18.34 78.11,7.62 78.74,6.99 88.9,6.99 ADCH.7
ADC15  (via drill 0.41)
  Top 0.203: ATMEGA1280.82 73.51,37.87 73.51,40.03 73.69,40.21 v73.99,41
  Bottom 0.203: v73.99,41 73.53,40.39 73.48,39.83 73.51,39.8 73.51,33.1 72.39,31.95 72.39,24.77 78.74,18.41 78.74,7.62 91.44,7.62 ADCH.8
AREF  (via drill 0.41)
  Top 0.203: ATMEGA1280.98 65.53,39.47 63.32,41.33 63.35,43.92 | v63.37,45.54 63.35,43.92 | v32.18,56.92 24.16,52.43 PWMH.8 | C4.1 70.28,43.94 63.35,43.92
  Bottom 0.203: v63.37,45.54 51.94,45.57 51.99,56.92 v32.18,56.92
DTR  (via drill 0.41)
  Top 0.203: v23.65,60.35 20.65,45.85 19.07,42.72 19.05,24.13 12.06,24.13 12.06,19.05 GE863.39_C108/DTR | v39.45,58.45 SW1.P$2
  Bottom 0.203: v23.65,60.35 35.56,60.33 v39.45,58.45
GND  (via drill 0.71)  (1 unrouted)
  Top 0.203: 44.99,21.33 TC7W125FU.4
  Top 0.305: C7.2 73.98,44.41 | 75.89,11.52 76,11.43 | C9.1 64.12,10.3 | 66.73,12.5 66.73,18.26 67.49,19.56 67.49,21.79 ATMEGA1280.32 67.46,21.92 67.54,22.81 68.05,23.57 | 73.98,47.62 C6.2 C4.2 C5.2 | 65.08,34.98 ATMEGA1280.99 | 73.28,34.24 73.03,34.24 | ATMEGA1280.11 63.5,30.84 64.62,29.69 | 37.87,22.05 41.45,22.07 42.22,22.61 TC7W125FU.2 44.55,22.61 | U1.GND 16.51,62.23 | 10.79,57.78 C1.NEG | v43.16,58.52 SW1.P$1 v46.66,59.77 | 44.55,22.61 44.98,22.58 44.99,21.33 | 44.55,22.61 TC7W125FU.7 | 67.72,24.16 67.74,24.05 | 64.29,30 64.14,29.84 | 9.25,3.28 9.3,3.23 | 9.25,6.31 GE863.45_GND | T1.E | T1.E 57.48,64.14 56.97,64.14 56.97,64.19 57,64.19 R4.1 55.27,66.12 55.27,63.58 v53.65,63.58 53.57,63.58 POWER.2IN | 35.02,6.63 GE863.56_GND | ATMEGA1280.62 77.33,29.34 76.83,29.84 76.83,31.04 v76.63,31.24 | ATMEGA1280.81 73.98,36.93 73.71,36.65 73.71,34.42 73.76,34.38
  Top 0.508: ICSP1.6 79.5,11.46 76,11.43 | C10.1 75.89,11.52 | 65.46,34.19 65.08,34.98
  Top 0.813: 73.98,44.41 v75.21,43.18 | C10.1 66.73,12.5 66.34,12.52 64.12,10.3 | 73.98,47.62 C7.2 | 65.46,34.19 69.09,34.19 73.03,34.24 | 73.28,34.24 73.76,34.38 74.4,33.83 v74.5,34.04 | v74.07,26.29 67.67,26.26 67.72,24.16 | v35.26,41.3 GE863.17_GND | GSM_ANTENNA.P$2 GSM_ANTENNA.P$3 | GSM_ANTENNA.P$2 GE863.48_GND 15.24,9.53 GE863.72_GND | GE863.72_GND GE863.77_GND | GE863.72_GND GE863.67_GND 23.49,13.05 | 80.01,47.62 C6.2 | v87.63,47.62 80.01,47.62 | v9.4,44.02 GE863.28_GND | 37.87,22.05 GE863.8_GND 35.23,22.96 35.23,17.83 25.4,17.78 25.4,26.04 GE863.69_GND | 23.49,13.05 23.9,13.06 23.82,26.01 GE863.69_GND | GE863.69_GND v20.95,27.3 | v15.47,27.3 GE863.79_GND GE863.36_GND | GE863.69_GND v22.2,30.61 | GE863.56_GND POWER1.5 POWER1.4 | 80.01,47.62 AGND.P$1 | 60.96,10.48 C9.1 | 60.96,10.48 C8.1 | 64.62,29.69 64.36,23.52 v62.61,22.05 | v60.96,12.06 60.96,10.48 | 67.74,24.05 68.05,23.57 | v73.71,29.62 64.62,29.69 | 64.62,29.69 64.29,30 | 9.3,3.23 GSM_ANTENNA.P$2 | 9.25,3.28 9.25,6.31 | 35.02,6.63 33.45,8.2 28.29,8.26 23.49,13.05
  Top 1.016: R1.1 C2.2 C3.2 22.78,64.59 16.46,64.49 U1.GND 16.46,59.79 11.23,59.79 C1.NEG | 10.79,57.78 14.61,57.78 v14.68,50.44 | GND_INPUT.1 85.09,76.83 69.85,76.83 v69.85,75.56
  Bottom 0.305: 29.21,41.27 SIM5036.CD_2 28.88,47.73 PWMH.7 | SIM5036.4_GND 21.23,39.52 | v43.16,58.52 44.27,58.55 44.27,67.33 34.92,67.31 R1.1 | v46.66,59.77 v53.65,63.58 | 57.12,12.24 57.1,12.06 | 14.58,39.55 14.61,39.57
  Bottom 0.813: v74.5,34.04 v76.63,31.24 | v74.5,34.04 v73.71,29.62 v74.07,26.29 | 29.21,41.27 v35.26,41.3 | v87.63,47.62 88.27,48.26 88.18,69.85 | SIM5036.CD_2 28.88,36.12 22.23,36.12 | 22.23,36.12 21.31,36.02 SIM5036.4_GND | 21.23,39.52 14.58,39.55 14.45,39.5 v9.4,44.02 | v20.95,27.3 v15.47,27.3 | v22.2,30.61 22.23,36.12 | 88.18,69.85 88.16,73.69 GND_INPUT.1 | 88.18,69.85 98.42,69.85 98.42,7.62 JP5.1 JP6.1 | v75.21,43.18 75.51,41.27 75.06,38.41 74.7,34.75 v74.5,34.04 | v62.61,22.05 58.29,22 57.12,20.93 57.12,12.24 | 57.1,12.06 v60.96,12.06 | 14.61,39.57 v14.68,50.44
  Bottom 1.016: v69.85,75.56 55.88,75.56 55.88,71.75 36.83,71.75 R1.1
  pour Top (isolate 0.381): 0.64,79.38 99.69,79.38 99.69,0 0.64,0
  pour Bottom (isolate 0.305): 0.64,79.38 99.69,79.38 99.69,0.64 0,0.64
GSM_ON/OFF_I/O  (via drill 0.41)
  Top 0.203: 62.87,63.5 R3.2 v62.87,65.41 | v68.58,65.41 68.58,57.78 83.25,57.78 TELIT_ON/OFF.P$1
  Bottom 0.203: v62.87,65.41 v68.58,65.41
N$1
  Top 0.203: TC7W125FU.6 48.13,21.97 SJ2.2 48.13,29.87 R8.1
N$2
  Top 0.203: GSM_ANTENNA.P$1 GE863.49_ANTENNA
N$3
  Top 0.203: SJ5.1 42.82,21.97 TC7W125FU.3
N$4  (via drill 0.41)
  Top 0.203: R5.1 3.17,48.84 v8.89,48.84 | SW1.P$3 37.47,60.35 37.47,60.33 25.81,60.33 v25.81,55.42
  Bottom 0.203: v25.81,55.42 21.69,55.45 v8.89,48.84
N$5
  Top 0.203: TC7W125FU.1 SJ4.1
N$6  (via drill 0.41)
  Top 0.203: ATMEGA1280.34 68.48,20.23 v68.4,14.25 | Q1.1 63.5,15.75 C9.2
  Bottom 0.203: v68.4,14.25 64.9,14.25 Q1.1
N$7  (via drill 0.41)
  Top 0.203: ATMEGA1280.33 68.01,18.4 v67.67,17.83 | Q1.2 58.42,15.75 C8.2
  Bottom 0.203: v67.67,17.83 58.52,17.8 Q1.2
N$23
  Top 0.203: GPS_ANTENNA.P$1 GE863.83_GPS_ANT
N$25  (via drill 0.41)
  Top 0.203: v23.82,44.25 GE863.22_SIMVCC
  Bottom 0.203: v23.82,44.25 23.75,42.98 20.04,42.95 SIM5036.1_VCC
N$26  (via drill 0.41)
  Top 0.203: v27.64,44.25 GE863.21_SIMIN
  Bottom 0.203: SIM5036.CD_1 v27.64,44.25
N$27  (via drill 0.41)
  Top 0.203: v26.36,43.18 29.21,43.23 29.16,45.52 GE863.20_SIMIO
  Bottom 0.203: SIM5036.6_I/O 26.44,43.03 v26.36,43.18
N$28  (via drill 0.41)
  Top 0.203: v23.72,38.12 29.84,38.17 29.84,38.73 29.84,39.37 31.11,40.64 31.11,45.72 GE863.19_SIMRST
  Bottom 0.203: SIM5036.2_RESET v23.72,38.12
N$29  (via drill 0.41)
  Top 0.203: v27.41,37.39 33.17,37.44 GE863.18_SIMCLK
  Bottom 0.203: SIM5036.3_CLOCK 25.12,37.97 25.15,37.41 v27.41,37.39
N$34
  Top 0.203: GE863.84_GND_GPS GPS_ANTENNA.P$3 GPS_ANTENNA.P$2
N$53
  Top 0.203: R3.1 62.71,60.96 60.33,60.96 60.33,61.98 60.31,61.96 T1.B 59.41,61.96 59.41,64.19 59.84,64.19 59.84,64.21 | 59.84,64.21 | 59.84,64.21 R4.2
ON/OFF
  Top 0.203: GE863.46_ON_OFF 11.23,13.95 19.94,13.92 19.91,40.59 20.07,42.67 21.23,45.21 24.94,61.54 44.22,61.57 44.22,62.97 52.05,62.97 POWER.4OUT 53.59,61.68 53.59,60.05 T1.C
PA0
  Top 0.203: ATMEGA1280.78 75.51,37.87 75.51,40.28 75.87,40.64 83.82,40.64 91.44,48.26 JP1.16
PA1
  Top 0.203: ATMEGA1280.77 75.98,39.79 76.2,40.01 84.45,40.01 91.44,46.99 95.25,46.99 JP1.15
PA2
  Top 0.203: ATMEGA1280.76 76.48,39.02 76.83,39.37 85.09,39.37 91.44,45.72 JP1.14
PA3
  Top 0.203: ATMEGA1280.75 78.48,38.48 78.74,38.73 86.36,38.73 92.08,44.45 95.25,44.45 JP1.13
PA4
  Top 0.203: ATMEGA1280.74 80.25,35.34 80.26,35.36 80.26,37.77 80.67,38.18 87.71,38.18 92.71,43.18 JP1.12
PA5
  Top 0.203: ATMEGA1280.73 81.2,34.84 81.28,34.92 81.28,37.34 81.41,37.47 88.9,37.47 93.34,41.91 96.52,41.91 JP1.11
PA6
  Top 0.203: ATMEGA1280.72 81.97,34.34 82.55,34.92 82.55,36.83 89.15,36.85 89.31,36.85 92.94,40.49 93.83,40.49 JP1.10
PA7
  Top 0.203: ATMEGA1280.71 82.74,33.84 83.19,34.29 83.19,36.2 89.53,36.2 92.71,39.37 95.25,39.37 JP1.9
PB0
  Top 0.203: ATMEGA1280.19 52.3,26.8 52.38,4.95 90.17,5.08 90.17,5.56 93.5,8.89 96.47,8.89 96.52,8.94 JP2.1
PB1  (via drill 0.41)
  Top 0.203: ATMEGA1280.20 52.88,26.29 52.93,5.56 88.8,5.79 JP2.2 | ICSP1.3 85.09,13.34 90.17,13.34 v91.44,12.06
  Bottom 0.203: JP2.2 v91.44,12.06
PB2  (via drill 0.41)
  Top 0.203: ATMEGA1280.21 53.54,25.83 53.54,6.4 88.27,6.35 v90.49,8.57 93.34,11.43 96.52,11.43 JP2.3
  Bottom 0.203: ICSP1.4 85.09,10.79 87,10.79 89.22,8.57 v90.49,8.57
PB3
  Top 0.203: ATMEGA1280.22 53.98,25.4 53.98,6.99 87,6.99 91.03,10.52 | 91.03,10.52 JP2.4 | ICSP1.1 89.63,12.07 91.03,10.52
PB4  (via drill 0.41)
  Top 0.203: ATMEGA1280.23 59.23,24.84 v58.24,24.46
  Bottom 0.203: v58.24,24.46 58.17,28.14 54.38,28.14 54.3,31.06 46.84,31.11 37.74,45.41 36.83,47.62 PWMH.3
PB5  (via drill 0.41)
  Top 0.203: ATMEGA1280.24 60.78,24.33 60.78,23.32 57.4,23.32 v56.82,24.05
  Bottom 0.203: v56.82,24.05 56.77,27.38 53.59,27.41 53.59,30.23 46.18,30.28 34.29,48.9 PWMH.4
PB6  (via drill 0.41)
  Top 0.203: ATMEGA1280.25 61.29,22.71 v55.55,22.71
  Bottom 0.203: v55.55,22.71 55.55,26.67 52.78,26.72 52.78,29.57 45.59,29.64 45.64,29.64 45.59,29.67 PWMH.5
PB7  (via drill 0.41)
  Top 0.203: ATMEGA1280.26 64.16,21.06 54.74,21.08 v54.74,24.23
  Bottom 0.203: v54.74,24.23 54.71,25.63 51.97,25.7 51.92,28.83 45.11,28.88 32.38,47.62 29.84,47.62 29.21,49.53 PWMH.6
PC0
  Top 0.203: ATMEGA1280.53 88.34,24.84 92.71,29.21 95.25,29.21 JP1.1
PC1
  Top 0.203: ATMEGA1280.54 87.58,25.34 92.71,30.48 JP1.2
PC2
  Top 0.203: ATMEGA1280.55 86.81,25.84 92.71,31.75 96.52,31.75 JP1.3
PC3
  Top 0.203: ATMEGA1280.56 86.03,26.34 92.71,33.02 JP1.4
PC4
  Top 0.203: ATMEGA1280.57 85.27,26.84 92.71,34.29 95.25,34.29 JP1.5
PC5
  Top 0.203: ATMEGA1280.58 84.42,27.34 84.45,27.3 92.71,35.56 JP1.6
PC6
  Top 0.203: ATMEGA1280.59 83.72,27.84 92.71,36.83 96.52,36.83 JP1.7
PC7
  Top 0.203: ATMEGA1280.60 82.95,28.34 92.71,38.1 JP1.8
PD7  (via drill 0.41)
  Top 0.203: ATMEGA1280.50 79,21.84 80.01,22.86 v90.81,22.86
  Bottom 0.203: v90.81,22.86 90.81,25.4 92.08,26.67 92.71,26.67 JP2.16
PE0
  Top 0.203: ATMEGA1280.2 61.29,35.33 61.32,48.56 PWML.1
PE1
  Top 0.203: ATMEGA1280.3 60.63,34.85 60.63,49.23 PWML.2
PE3
  Top 0.203: ATMEGA1280.5 57.25,33.86 57.25,48.26 50.8,48.26 PWML.6
PE4  (via drill 0.41)
  Top 0.203: ATMEGA1280.6 59.26,33.35 v58.29,32.84 | v58.32,36.07 PWML.3
  Bottom 0.203: v58.29,32.84 v58.32,36.07
PE5  (via drill 0.41)
  Top 0.203: ATMEGA1280.7 60.27,32.84 56.34,30.94 v56.34,47.37
  Bottom 0.203: v56.34,47.37 PWML.4
PG0
  Top 0.203: ATMEGA1280.51 92.42,23.84 92.71,24.13 95.25,24.13 JP2.13
PG1
  Top 0.203: ATMEGA1280.52 89.75,24.34 90.81,25.4 JP2.14
PG2  (via drill 0.41)
  Top 0.203: ATMEGA1280.70 87.02,33.34 87.17,33.5 87.2,33.5 v88.32,35.26
  Bottom 0.203: v88.32,35.26 88.27,33.02 92.08,29.21 96.52,29.21 JP2.15
PG5  (via drill 0.41)
  Top 0.203: ATMEGA1280.1 v62.46,48.34
  Bottom 0.203: v62.46,48.34 57.17,48.34 57.2,46.38 53.34,46.51 PWML.5
PH3
  Top 0.203: ATMEGA1280.15 55.4,28.85 55.4,46.38 48.26,46.38 PWML.7
PH4
  Top 0.203: ATMEGA1280.16 54.63,28.32 54.63,45.62 45.72,45.62 PWML.8
PH5
  Top 0.203: ATMEGA1280.17 53.72,27.86 53.8,44.83 41.99,44.83 PWMH.1
PH6
  Top 0.203: ATMEGA1280.18 52.7,27.3 52.7,43.81 39.37,43.81 PWMH.2
PL0
  Top 0.203: ATMEGA1280.35 68.98,15.47 70.48,13.97 95.25,13.97 JP2.5
PL1
  Top 0.203: ATMEGA1280.36 69.55,21.79 69.55,16.08 71.09,14.53 93.27,14.53 JP2.6
PL2
  Top 0.203: JP2.7 96.52,16.51 93.6,16.51 92.13,15.04 71.42,15.04 69.98,16.48 ATMEGA1280.37
PL3
  Top 0.203: ATMEGA1280.38 70.48,16.87 71.81,15.54 91.75,15.54 JP2.8
PL4
  Top 0.203: 96.52,19.23 96.52,19.05 | 96.52,19.23 JP2.9 | ATMEGA1280.39 70.98,17.33 72.24,16.08 90.7,16.08 93.67,19.05 96.34,19.05 96.52,19.23
PL5
  Top 0.203: ATMEGA1280.40 71.55,20.04 71.55,17.65 72.59,16.61 90.27,16.61 JP2.10 92.99,19.51
PL6
  Top 0.203: ATMEGA1280.41 72.01,20.24 72.01,18.03 72.82,17.22 88.86,17.22 92.25,20.61 | 92.25,20.61 91.9,20.27 | 92.25,20.61 93.17,21.51 96.01,21.51 JP2.11
PL7
  Top 0.203: ATMEGA1280.42 72.44,20.65 72.44,18.57 73.2,17.8 87.83,17.8 92.58,22.55 93.67,22.55 JP2.12
REG_OUTPUT
  Top 0.61: U1.OUTPUT 8.26,62.23 | 24.77,78.11 R2.2
  Top 1.676: SJ3.1 REG_VCC_OUT.1 36.83,75.56 36.83,78.11 24.77,78.11 8.26,78.11 8.26,62.23 | SJ6.1 U1.OUTPUT
RESET  (via drill 0.41)
  Top 0.203: v79.6,9.42 78.38,9.4 R9.2 78.26,10.01 77.47,10.79 73.03,10.79 73.03,8.89 55.88,8.89 v55.96,9.58 | ICSP1.5 80.64,12.7 C10.2 | ATMEGA1280.30 66.5,21.83 66.5,20.47 65.79,20.14 v55.83,20.24
  Bottom 0.203: v79.6,9.42 80.01,9.65 80.01,11.43 80.64,12.06 ICSP1.5 | v55.83,20.24 v55.96,9.58 50.8,9.53 POWER1.1
RXD  (via drill 0.41)
  Top 0.203: RX/TX_TELIT.P$1 SJ4.2 | v11.23,25.38 10.67,25.38 10.67,21.08 7.53,21.08 GE863.38_C104/RXD
  Bottom 0.203: v11.23,25.38 33.86,25.22 36.37,25.22 36.83,24.77 36.83,23.5 40.66,23.5 RX/TX_TELIT.P$1
RXD1  (via drill 0.41)
  Top 0.203: ATMEGA1280.45 73.98,20 74.22,19.76 82.98,19.76 v83.77,20.55
  Bottom 0.203: v83.77,20.55 83.77,47.57 83.82,47.62 83.82,48.26 COMMUNICATION.3
RXD2  (via drill 0.41)
  Top 0.203: v59.64,37.47 59.66,54.1 v63.4,54.1 | ATMEGA1280.12 61.21,30.35 61.21,31.29 v59.28,31.29
  Bottom 0.203: v59.28,31.29 59.64,32.08 v59.64,37.47 | v63.4,54.1 76.17,54.13 COMMUNICATION.5
RXD3  (via drill 0.41)
  Top 0.203: v81.92,29.84 ATMEGA1280.63 | v43.41,41.48 45.16,41.5 45.21,30.86 49.53,30.86 49.53,26.67 SJ2.1 RX/TX_ATMEL.P$2 | v43.43,53.11 43.48,54.13 57.17,54.1 57.23,55.3 v64.31,55.24 | v71.17,55.27 COMMUNICATION.7
  Bottom 0.203: v81.92,29.84 81.92,46.35 79.38,48.9 71.75,48.9 71.75,50.16 COMMUNICATION.7 | v43.41,41.48 v43.43,53.11 | v64.31,55.24 v71.17,55.27
SCL  (via drill 0.41)
  Top 0.203: v64.24,68.38 R6.2 | ATMEGA1280.43 73.03,19.05 73.66,18.41 86.36,18.41 v86.36,19.68
  Bottom 0.203: v64.24,68.38 86.36,68.35 COMMUNICATION.1 v86.36,19.68
SDA  (via drill 0.41)
  Top 0.203: ATMEGA1280.44 73.48,19.5 73.76,19.23 84.25,19.23 v84.71,19.68 | 57.78,70.48 R7.2 v57.78,68.33
  Bottom 0.203: v84.71,19.68 84.71,49.91 COMMUNICATION.2 83.8,66.9 64.19,66.9 v57.78,68.33
SENCE
  Top 0.203: R2.1 34.92,72.39 24.77,72.39 R1.2 24.77,67.31 22.23,65.71 14.81,65.66 U1.SENCE
TXD  (via drill 0.41)
  Top 0.203: RX/TX_TELIT.P$2 SJ5.2 | GE863.37_C103/TXD v9.3,24.49
  Bottom 0.203: v9.3,24.49 35,24.49 35.74,24 35.69,20.9 RX/TX_TELIT.P$2
TXD1  (via drill 0.41)
  Top 0.203: ATMEGA1280.46 74.48,20.59 74.6,20.47 82.09,20.47 v82.7,21.08
  Bottom 0.203: v82.7,21.08 82.7,46.84 COMMUNICATION.4
TXD2  (via drill 0.41)
  Top 0.203: ATMEGA1280.13 61.14,29.84 v60.35,29.82
  Bottom 0.203: v60.35,29.82 60.38,31.6 60.38,36.63 64.72,45.67 64.77,53.14 73.74,53.21 COMMUNICATION.6
TXD3  (via drill 0.41)
  Top 0.203: ATMEGA1280.64 80.51,30.34 v80.54,31.24 | SJ1.1 RX/TX_ATMEL.P$1 51.44,20.95 51.44,32.38 46.35,32.38 46.33,42.7 v44.45,42.7 | v44.45,55.02 44.48,56.34 v63.48,56.36 | v68.58,56.44 COMMUNICATION.8
  Bottom 0.203: COMMUNICATION.8 71.12,48.26 78.74,48.26 81.28,45.72 81.28,31.75 v80.54,31.24 | v44.45,42.7 v44.45,55.02 | v63.48,56.36 v68.58,56.44
TXD_IN
  Top 0.203: SJ1.2 TC7W125FU.5
VCC  (via drill 0.71)
  Top 0.203: ATMEGA1280.31 66.98,21.91
  Top 0.305: 64.31,31.37 ATMEGA1280.10 | 64.24,37.82 ATMEGA1280.100 | 76.38,28.85 ATMEGA1280.61 | 66.98,23.16 ATMEGA1280.31 | 66.98,21.91 67.01,20.22 66.04,19.05 | ATMEGA1280.80 74.48,36.64 74.93,36.2
  Top 0.457: 66.34,23.57 66.98,23.16
  Top 0.508: ICSP1.2 86.31,9.47 86.31,7.95 86.18,7.82 75.29,7.82 75.41,7.95 R9.1 74.14,8.26 55.24,8.26 54.86,8.89 54.79,19.05 54.8,19.05 66.04,19.05 | C5.1 65.41,45.09 v66.04,47.62 C6.1 | v77.47,43.81 77.47,43.49 C7.1 | 76.26,34.98 v76.53,34.9 75.23,36.2 74.93,36.2 | 64.31,31.37 64.24,37.82 | 75.74,28.07 76.38,28.85 | POWER1.3 40.64,7.85 35.56,7.85 35.56,15.24 v28.37,15.24 | v26.98,22.23 29.21,26.04 29.21,34.92 34.92,34.92 34.92,38.08 39.37,38.08 R8.2
  Top 0.813: 75.74,28.07 66.27,28.04 66.34,23.57
  Top 1.016: 74.93,31.4 75.74,28.07 | v76.53,34.9 74.93,31.4 | 74.93,31.4 64.31,31.37 | v40.64,54.61 44.5,57.56 52.76,57.56 55.35,57.99 66.04,57.99
  Top 1.676: v66.04,47.62 66.04,57.99 66.12,73.36 R6.1 R7.1 VCC_ATMEL_IN/OUT.1 SJ3.2
  Bottom 0.508: v28.37,15.24 28.37,20.32 26.92,20.32 v26.98,22.23 | R8.2 40.64,43.18 v40.64,54.61
  Bottom 1.27: v76.53,34.9 76.83,38.1 v77.47,43.81
  Bottom 1.676: v66.04,47.62 67.31,47.62 68.58,46.35 76.2,46.35 77.47,45.09 v77.47,43.81
VCC5V  (via drill 0.71)
  Top 1.27: v19.91,58.19 U1.VIN C3.1 32.16,63.75 C2.1 34.92,64.77 v38.1,69.85
  Bottom 1.016: v19.91,58.19 5.08,51.44 5.08,17.78 7.75,17.86 7.75,3.81 31.11,3.81 POWER1.6
  Bottom 1.27: VCC_INPUT.1 71.75,73.66 71.75,69.85 v38.1,69.85
VCC/2  (via drill 0.71)
  Top 0.61: C1.POS 11.43,50.8 | 9.55,52.65 11.18,50.16
  Top 1.016: v7.37,50.72 9.55,52.65
  Top 1.422: GE863.27_VBATT 11.18,50.16 C1.POS SJ6.2
  Bottom 1.016: POWER1.2 43.16,6.78 12.72,6.76 12.7,18.41 10.16,18.41 10.16,20.32 7.37,20.24 v7.37,50.72

### Text on the board
tNames: ATMEL | JUMP | DTR | TELIT_ON/OFF | To columbia with love, FROM: | TELIT | GROUND LAB | HIGH | LOW | JUMP | GND | GPSNEMA | AREF | GND | PB7 | PB6 | PB5 | PB4 | PH6 | PH5 | PH4 | PH3 | PE3 | PG5 | PE5 | PE4 | PE1 | PE0 | TXD3 | RXD3 | TXD2 | RXD2 | TXD1 | RXD1 | SDA | SCL | TELIT_ON/OFF | RX | TX | PA0/1 | AGND | PA2/3 | PA4/5 | PA6/7 | PC7/6 | PC5/4 | PC3/2 | PC1/0 | GPS | PD7/PG2 | RXD | PG1/0 | PL7/6 | PL5/4 | PL3/2 | TXBIN | RXBIN | TXD | PL1/0 | 4 | PB2/3 | 3 | RXGPS | PA0/1 | 2 | Telit_I/O | TXGPS | 1 | ADC0 | ADC1 | ADC2 | ADC3 | ADC4 | ADC5 | ADC6 | ADC7 | ADC8 | ADC9 | ADC10 | ADC11 | ADC12 | ADC13 | ADC14 | ADC15 | GSM